# EAGLE schematic Receiver (EAGLE 9.2.2)
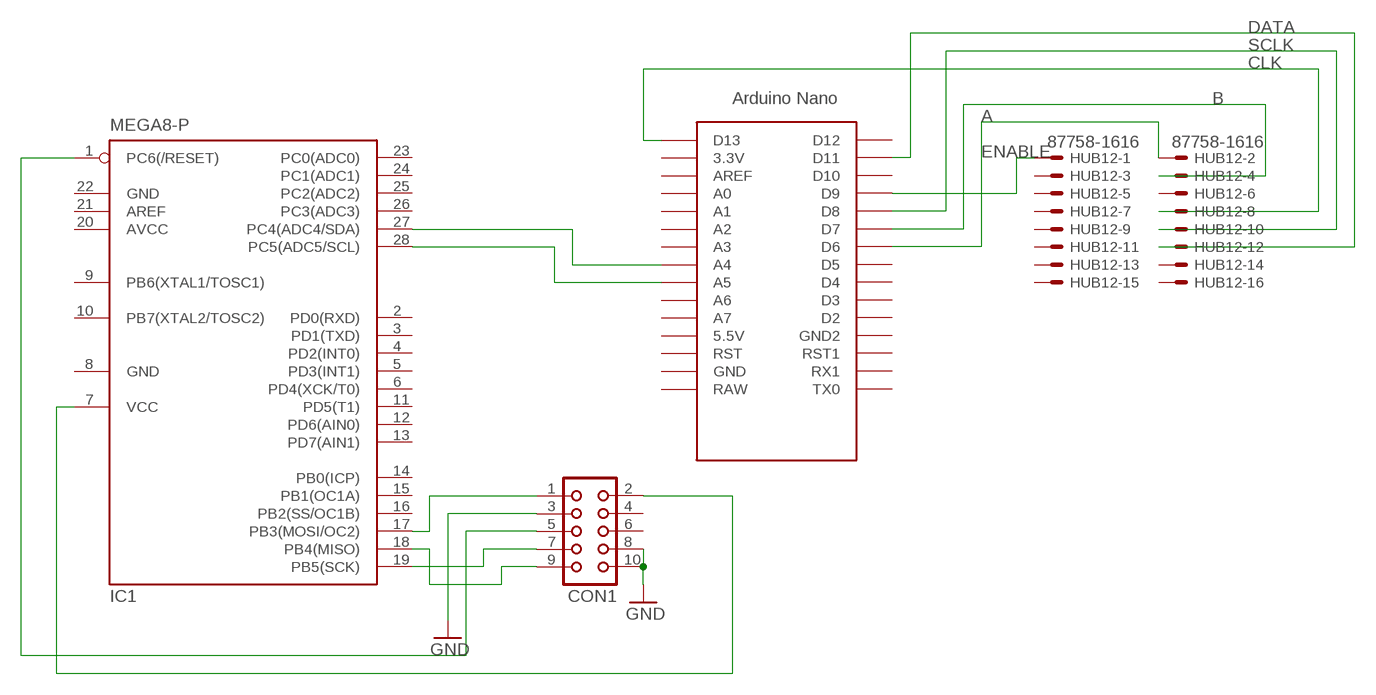
[diagram p0: schematic, sheet 1]

## Parts
CON1  CON10  [CON10]
HUB12  87758-1616  [87758-1616]
IC1  MEGA8-P  [DIL28-3]
U$1  NANO  [NANO]

## Nets
A: HUB12.2 U$1.D6
B: HUB12.4 U$1.D7
CLK: HUB12.8 U$1.D13
DATA: HUB12.12 U$1.D11
ENABLE: HUB12.1 U$1.D9
GND: CON1.3 CON1.8 CON1.10
N$1: IC1.28(PC5(ADC5/SCL)) U$1.A5
N$2: IC1.27(PC4(ADC4/SDA)) U$1.A4
N$3: CON1.1 IC1.17(PB3(MOSI/OC2))
N$4: CON1.2 IC1.7(VCC)
N$5: CON1.5 IC1.1(PC6(/RESET))
N$6: CON1.7 IC1.19(PB5(SCK))
N$7: CON1.9 IC1.18(PB4(MISO))
SCLK: HUB12.10 U$1.D8
Unconnected: CON1.4 CON1.6 HUB12.3 HUB12.5 HUB12.6 HUB12.7 HUB12.9 HUB12.11 HUB12.13 HUB12.14 HUB12.15 HUB12.16 IC1.2(PD0(RXD)) IC1.3(PD1(TXD)) IC1.4(PD2(INT0)) IC1.5(PD3(INT1)) IC1.6(PD4(XCK/T0)) IC1.9(PB6(XTAL1/TOSC1)) IC1.10(PB7(XTAL2/TOSC2)) IC1.11(PD5(T1)) IC1.12(PD6(AIN0)) IC1.13(PD7(AIN1)) IC1.14(PB0(ICP)) IC1.15(PB1(OC1A)) IC1.16(PB2(SS/OC1B)) IC1.21(AREF) IC1.23(PC0(ADC0)) IC1.24(PC1(ADC1)) IC1.25(PC2(ADC2)) IC1.26(PC3(ADC3)) U$1.3.3V U$1.5V(5.5V) U$1.A0 U$1.A1 U$1.A2 U$1.A3 U$1.A6 U$1.A7 U$1.AREF U$1.D2 U$1.D3 U$1.D4 U$1.D5 U$1.D10 U$1.D12 U$1.GND U$1.GND1(GND2) U$1.ICSP1 U$1.ICSP2 U$1.ICSP3 U$1.ICSP4 U$1.ICSP5 U$1.ICSP6 U$1.RAW U$1.RST U$1.RST1 U$1.RX1 U$1.TX0

## Power pins joined to a net without a drawn wire
AVCC: IC1.20(AVCC)
GND: IC1.8(GND) IC1.22(GND)

## Library data of the parts
CON1 = con-harting:CON10: CONNECTOR; OC_FARNELL: unknown; OC_NEWARK: unknown
HUB12 = con-molex:87758-1616: 16 Pin - 2mm Dual Row Single Wafer, Vertical T/H HDR Source: http://www.molex.com/pdm_docs/sd/877580616_sd.pdf; MF: MOLEX; MPN: 87758-1616; OC_FARNELL: 7472366; OC_NEWARK: 59J1563
IC1 = atmel:MEGA8-P: MICROCONTROLLER 8 Kbytes FLASH, 1 kbytes SRAM, 512 bytes EEPROM, USART, 4-channel 10 bit ADC, 2-channel 8 bit ADC Pin compatible with Atmega48, ATMega88, ATMega168 Source: avr.lbr; OC_FARNELL: unknown; OC_NEWARK: unknown
U$1 = Arduino-clone:NANO: Arduino Nano